# EAGLE design rgbww32c3 (EAGLE 7.7.0)
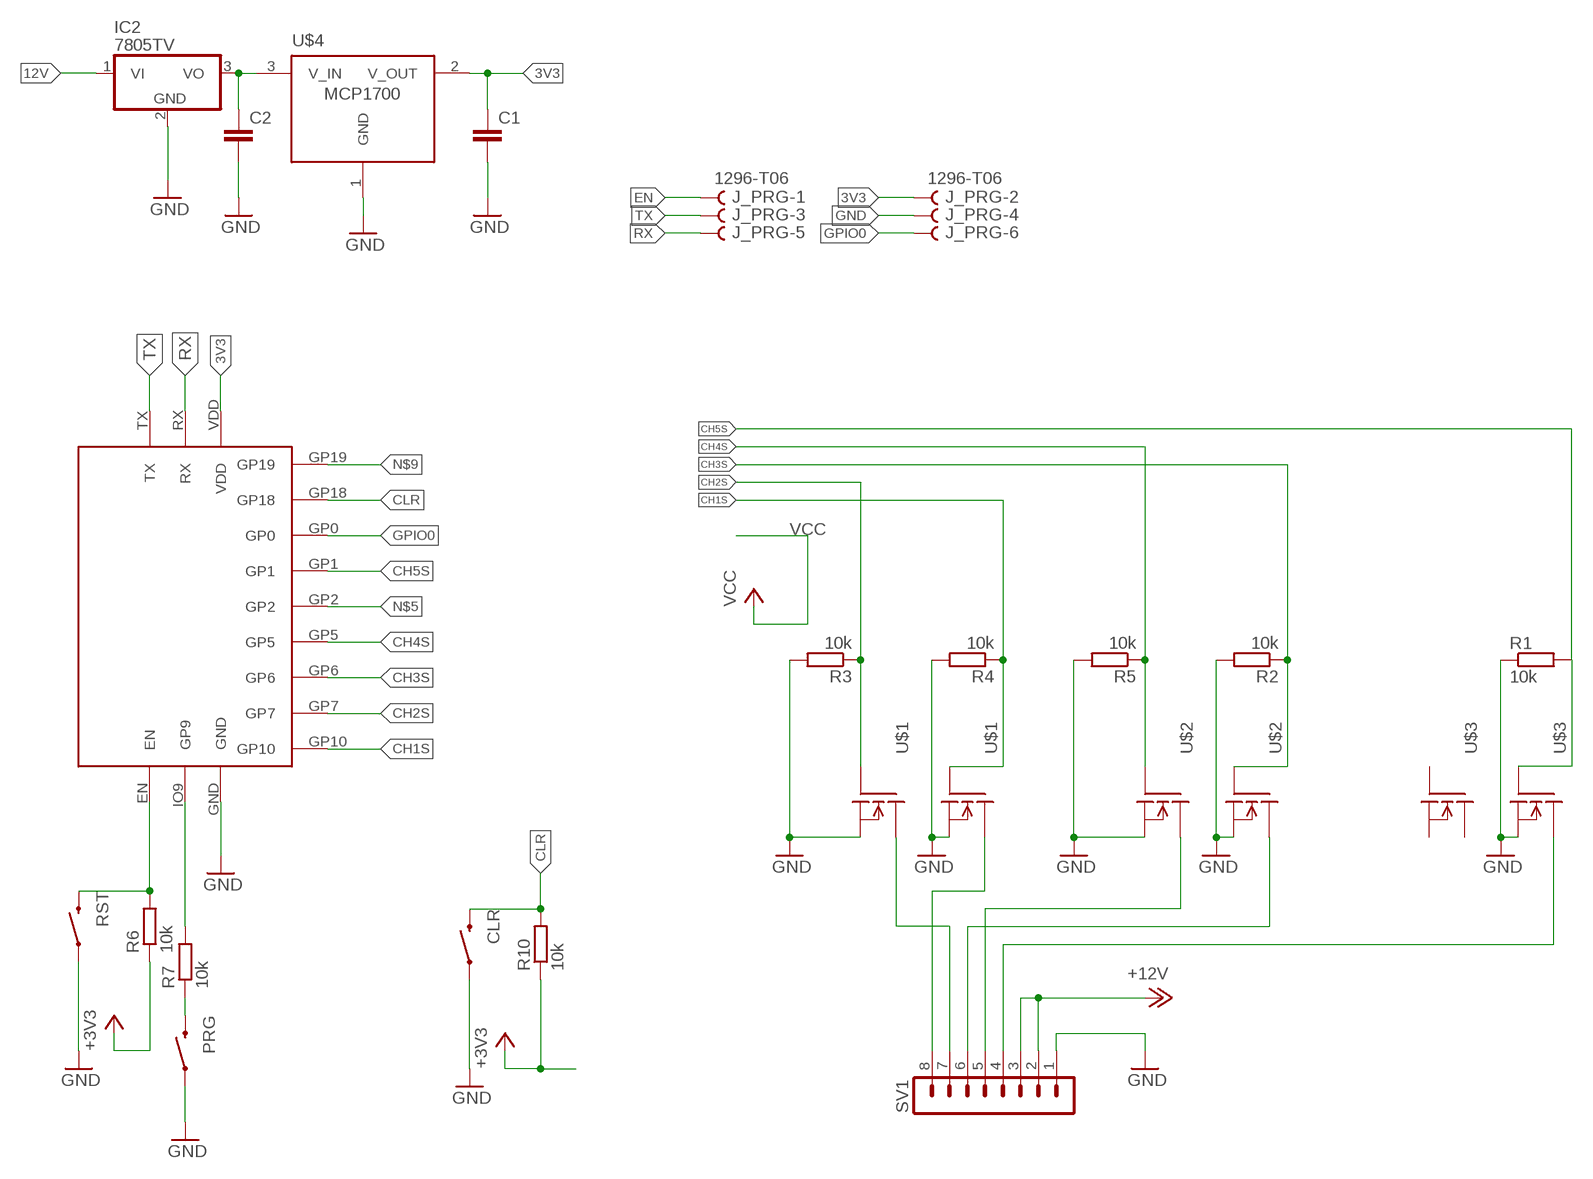
[diagram p0: schematic, sheet 1]

## Parts
C1  C-EUC1206  [C1206]
C2  C-EUC1206  [C1206]
CLR  SWITCH-MOMENTARY-2SMD-1101NE  [TACTILE-SWITCH-1101NE]
IC2  7805TV  [TO220V]
J_PRG  1296-T06  [06]
PRG  SWITCH-MOMENTARY-2SMD-1101NE  [TACTILE-SWITCH-1101NE]
R1  10k  R-EU_R0805  [R0805]
R2  10k  R-EU_R0805  [R0805]
R3  10k  R-EU_R0805  [R0805]
R4  10k  R-EU_R0805  [R0805]
R5  10k  R-EU_R0805  [R0805]
R6  10k  R-EU_R0805  [R0805]
R7  10k  R-EU_R0805  [R0805]
R10  10k  R-EU_R0805  [R0805]
RST  SWITCH-MOMENTARY-2SMD-1101NE  [TACTILE-SWITCH-1101NE]
SV1  MA08-1  [MA08-1]
U$1  AOD4806  [SO08]
U$2  AOD4806  [SO08]
U$3  AOD4806  [SO08]
U$4  MCP1700  MCP1700SOT23  [SOT-23]
U$5  ESP32-C3M_FLAT  [LAY_FLAT]

## Nets
3V3: C1.1 J_PRG.2 R6.1 R10.1 U$4.2(V_OUT) U$5.VDD ; supply symbol labelled +3V3
5V: C2.1 IC2.3(VO) U$4.3(V_IN)
12V: IC2.1(VI) SV1.2 SV1.3 ; supply symbol labelled +12V
CH1: SV1.8 U$1.5(D) U$1.6(D)
CH1S: R4.1 U$1.4(G) U$5.GP10
CH2: SV1.7 U$1.7(D1) U$1.8(D1)
CH2S: R3.1 U$1.2(G1) U$5.GP7
CH3: SV1.6 U$2.5(D) U$2.6(D)
CH3S: R2.1 U$2.4(G) U$5.GP6
CH4: SV1.5 U$2.7(D1) U$2.8(D1)
CH4S: R5.1 U$2.2(G1) U$5.GP5
CH5: SV1.4 U$3.5(D) U$3.6(D)
CH5S: R1.2 U$3.4(G) U$5.GP1
CLR: CLR.2 R10.2 U$5.GP18
EN [Signal]: J_PRG.1 R6.2 RST.2 U$5.EN
GND: C1.2 C2.2 CLR.1 IC2.2(GND) J_PRG.4 PRG.1 R1.1 R2.2 R3.2 R4.2 R5.2 RST.1 SV1.1 U$1.1(S1) U$1.3(S) U$2.1(S1) U$2.3(S) U$3.3(S) U$4.1(GND) U$5.GND
GPIO0: J_PRG.6 U$5.GP0
N$1: R7.2 U$5.IO9(GP9)
N$2: PRG.2 R7.1
N$5: U$5.GP2
N$9: U$5.GP19
RX: J_PRG.5 U$5.RX
TX: J_PRG.3 U$5.TX
Unconnected: U$3.1(S1) U$3.2(G1) U$3.7(D1) U$3.8(D1)

## Library data of the parts
C1 C2 = rcl:C-EU: CAPACITOR, European symbol
CLR PRG RST = SparkFun-Electromechanical:SWITCH-MOMENTARY-2: Various NO switches- pushbuttons, reed, etc; PROD_ID: SWCH-00815
IC2 = linear:78*: Positive VOLTAGE REGULATOR Source: http://cache.national.com/ds/LM/LM78L05.pdf http://www.fairchildsemi.com/ds/LM/LM7805.pdf
J_PRG = con-leotronics:1296-T06: 1.27mm SINGLE ROW FEMALE SOCKET Source: http://www.leotronics.co.uk/Conexcon/Data%20Sheets/sec.%20A/1296ing.pdf
R1-R7 R10 = rcl:R-EU_: RESISTOR, European symbol
SV1 = con-lstb:MA08-1: PIN HEADER; OC_FARNELL: unknown; OC_NEWARK: unknown
U$1-U$3 = esp12_RGBWW:AOD4806
U$4 = MCP1700:MCP1700SOT23
U$5 = ESP32C3M:ESP32-C3M_FLAT: ESP32 C3M module

## Net classes
5 Signal: width 0.381 mm

## Board
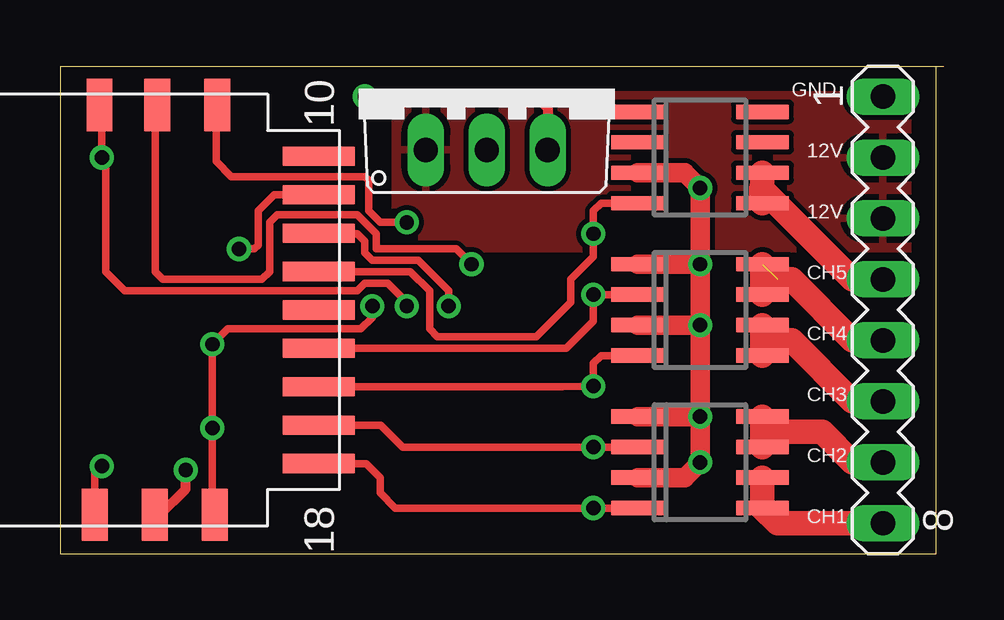
[diagram p1: board, top side]
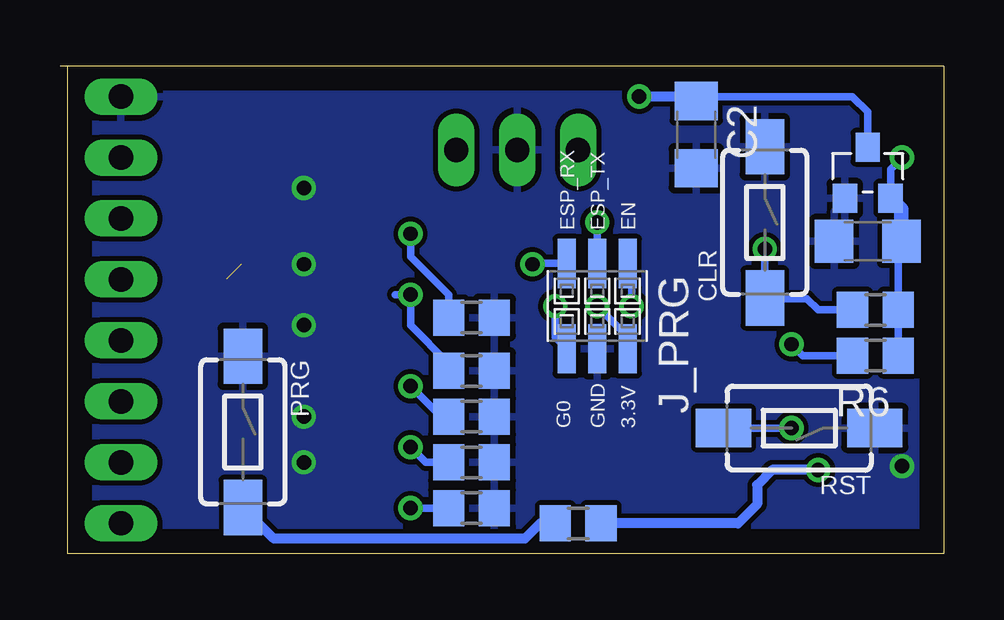
[diagram p2: board, bottom side, seen from below]

Size 36.83 x 20.32 mm. Coordinates in mm from the lower left corner, seen from the top.
Outline: 36.5,20.31 36.5,0 0,0 0,20.31
Outline: 0.01,20.32 36.83,20.32
Copper layers (1*16): Top 0.035mm / dielectric 1.5mm / Bottom 0.035mm
Design rules "default": minimum track width 10mil, minimum drill 24mil, track to track 8mil, track to pad 8mil, pad to pad 8mil, via to via 8mil, smd to smd 8mil, copper to edge 40mil, drill to drill 8mil, minimum pad ring 10mil, minimum via ring 8mil, stop-mask expansion 4mil, vias tented up to drill 0mil, thermal gap 10mil

### Footprints (pad centres in the part's own frame; a part is rotated, then mirrored left to right if it is on the bottom)
C1206 = smd 1.6 x 1.8: 1 -1.4,0; 2 1.4,0
TACTILE-SWITCH-1101NE = smd 2.3 x 1.6: 1 -3.15,0; 2 3.15,0
TO220V = drill 1.016 long: 1 -2.54,-2.54; 2 0,-2.54; 3 2.54,-2.54
06 = smd 0.76 x 2.05: 1 -1.27,-1.78; 2 -1.27,1.78; 3 0,-1.78; 4 0,1.78; 5 1.27,-1.78; 6 1.27,1.78
R0805 = smd 1.3 x 1.5: 1 -0.95,0; 2 0.95,0
MA08-1 = drill 1.016 long: 1 -8.89,0; 2 -6.35,0; 3 -3.81,0; 4 -1.27,0; 5 1.27,0; 6 3.81,0; 7 6.35,0; 8 8.89,0
SO08 = smd 0.6 x 2.2: 1 -1.905,-2.6; 2 -0.635,-2.6; 3 0.635,-2.6; 4 1.905,-2.6; 5 1.905,2.6; 6 0.635,2.6; 7 -0.635,2.6; 8 -1.905,2.6
SOT-23 = smd 1.016 x 1.2: 1 -0.95,-1.06; 2 0.95,-1.06; 3 0,1.06
LAY_FLAT = smd 2.184 x 1.067: EN -8.535,-12.8; GND -8.535,-7.8; IO9 -8.535,-10.3; RX 8.535,-10.4; TX 8.535,-12.9; VDD 8.535,-8 | smd 0.8 x 3: GP0 3.2,-17.135; GP1 1.6,-17.135; GP2 0,-17.135; GP5 -1.6,-17.135; GP6 -3.2,-17.135; GP7 -4.8,-17.135; GP10 -6.4,-17.135; GP18 4.8,-17.135; GP19 6.4,-17.135

### Placement (x,y rotation side)
C1  3.17,13.02 180 bottom
C2  10.32,17.46 270 bottom
CLR  7.46,13.81 270 bottom
IC2  17.78,19.37 0 top
J_PRG  14.45,10.32 180 bottom
PRG  29.21,5.08 270 bottom
R1  19.68,9.84 180 bottom
R2  19.68,5.72 0 bottom
R3  19.68,3.81 0 bottom
R4  19.68,1.91 0 bottom
R5  19.68,7.62 0 bottom
R6  2.86,8.25 180 bottom
R7  15.24,1.27 0 bottom
R10  2.86,10.16 180 bottom
RST  6.03,5.24 180 bottom
SV1  34.29,10.16 270 top
U$1  26.67,3.81 270 top
U$2  26.67,10.16 270 top
U$3  26.67,16.51 270 top
U$4  3.17,15.88 0 bottom
U$5  -6.35,10.16 90 top

### Tracks (layer width: path | path; a pad name or v marks a point on that pad's centre or on a via)
3V3  (via drill 0.6)
  Top 0.305: U$5.VDD 1.75,18.6 v1.75,16.51 1.91,16.35 1.91,11.75 2.7,10.95 12.38,10.95 12.7,11.27 13.65,11.27 14.45,10.48 v14.45,10.32
  Bottom 0.305: v1.75,16.51 2.23,16.03 U$4.2 1.91,14.5 | J_PRG.2 13.18,9.05 v14.45,10.32 | C1.1 1.91,12.89 R10.1 R6.1
  Bottom 0.61: C1.1 1.77,14.37 U$4.2
5V  (via drill 0.6)
  Top 0.406: v12.7,19.05 19.84,19.05 20.32,18.57 IC2.3
  Bottom 0.305: U$4.3 3.17,18.42 3.81,19.05 10.51,19.05 C2.1
  Bottom 0.406: 10.51,19.05 v12.7,19.05
12V
  pour Top: 13.97,20.32 36.83,20.32 36.83,12.7 13.97,12.7
CH1
  Top 1.016: SV1.8 29.91,1.27 U$1.5 U$1.6
CH1S  (via drill 0.6)
  Top 0.305: U$1.4 22.86,1.91 v22.23,1.91 13.97,1.91 13.34,2.54 13.34,3.18 12.75,3.76 U$5.GP10
  Bottom 0.305: v22.23,1.91 R4.1
CH2
  Top 1.016: SV1.7 33.02,3.81 31.75,5.08 29.91,5.08 U$1.8 U$1.7
CH2S  (via drill 0.6)
  Top 0.305: U$1.2 v22.23,4.45 14.29,4.45 13.37,5.36 U$5.GP7
  Bottom 0.305: v22.23,4.45 21.59,3.81 R3.1
CH3
  Top 1.016: SV1.6 33.02,6.35 30.48,8.89 29.91,8.89 U$2.5 U$2.6
CH3S  (via drill 0.6)
  Top 0.305: U$5.GP6 20.93,6.96 v22.23,6.98 22.23,7.94 22.54,8.25 U$2.4
  Bottom 0.305: R2.1 20.95,5.72 v22.23,6.98
CH4  (1 unrouted)
  Top 1.016: SV1.5 33.02,8.89 30.48,11.43 29.91,11.43 | U$2.7 U$2.8
CH4S  (via drill 0.6)
  Top 0.305: U$2.2 v22.23,10.8 22.23,9.68 21.1,8.56 U$5.GP5
  Bottom 0.305: 22.86,10.8 v22.23,10.8 22.23,9.53 21.59,8.89 21.27,8.57 20.64,7.94 R5.1
CH5
  Top 1.016: SV1.4 33.02,11.43 29.21,15.24 29.21,14.67 U$3.5 U$3.6
CH5S  (via drill 0.6)
  Top 0.305: U$5.GP1 14.59,11.76 15.4,10.95 15.4,9.37 15.72,9.05 19.84,9.05 21.27,10.48 21.27,11.43 22.23,12.38 v22.23,13.34 22.23,14.29 22.54,14.61 U$3.4
  Bottom 0.305: v22.23,13.34 22.23,12.38 20.64,10.79 R1.2
CLR  (via drill 0.6)
  Top 0.305: U$5.GP18 8.93,14.96 8.26,14.29 8.26,12.86 8.1,12.7 v7.46,12.7
  Bottom 0.305: R10.2 5.24,10.16 5.71,10.64 7.44,10.64 CLR.2 v7.46,12.7
EN  (via drill 0.6)
  Top 0.305: v13.02,10.32 13.02,9.84 12.54,9.37 6.99,9.37 v6.35,8.73 v6.35,5.24 6.35,1.73 U$5.EN
  Bottom 0.305: RST.2 v6.35,5.24 | 13.02,10.48 v13.02,10.32 13.02,11.94 J_PRG.1 | R6.2 5.87,8.25 v6.35,8.73
GND  (via drill 0.6)
  Top 0.305: U$5.GND 1.45,3.36 v1.75,3.65
  Top 0.813: U$3.3 26.04,15.88 v26.67,15.24 v26.67,12.06 | U$1.3 26.04,3.18 v26.67,3.81 v26.67,5.72 | v26.67,5.72 v26.67,9.53 | v26.67,9.53 v26.67,12.06 | U$2.1 v26.67,12.06 | U$2.3 v26.67,9.53 | U$1.1 v26.67,5.72
  pour Bottom: 0,20.32 36.83,20.32 36.83,0 0,0
GPIO0  (via drill 0.6)
  Top 0.305: U$5.GP0 10.81,13.34 12.38,13.34 12.7,13.02 12.7,12.54 13.02,12.22 14.92,12.22 16.19,10.95 v16.19,10.32
  Bottom 0.305: v16.19,10.32 16.19,9.02 J_PRG.6
N$1  (via drill 0.6)
  Top 0.406: U$5.IO9 4.17,1.62 5.24,2.7 v5.24,3.49
  Bottom 0.406: v5.24,3.49 7.14,3.49 7.78,2.86 7.78,2.06 8.57,1.27 R7.2
N$2
  Bottom 0.406: PRG.2 27.91,0.64 17.46,0.64 16.83,1.27 R7.1
RX  (via drill 0.6)
  Top 0.305: U$5.RX 3.97,18.61 3.97,11.75 4.29,11.43 8.41,11.43 8.73,11.75 8.73,13.81 9.05,14.13 12.38,14.13 13.18,13.34 13.18,12.7 16.51,12.7 v17.14,12.06
  Bottom 0.305: J_PRG.5 17.14,12.1 v17.14,12.06
TX  (via drill 0.6)
  Top 0.305: 6.55,18.62 U$5.TX 6.51,18.65 6.51,16.35 7.14,15.72 12.7,15.72 12.86,15.56 12.86,14.29 13.34,13.81 v14.45,13.81
  Bottom 0.305: J_PRG.3 v14.45,13.81

### Text on the board
tNames: GND | 12V | 12V | CH5 | CH4 | CH3 | CH2 | CH1
bNames: EN | ESP_TX | ESP_RX | 3.3V | GND | G0